# Altium schematic sheet EMMC.SchDoc
size A3; SheetNumber: 7; SheetTotal: 10
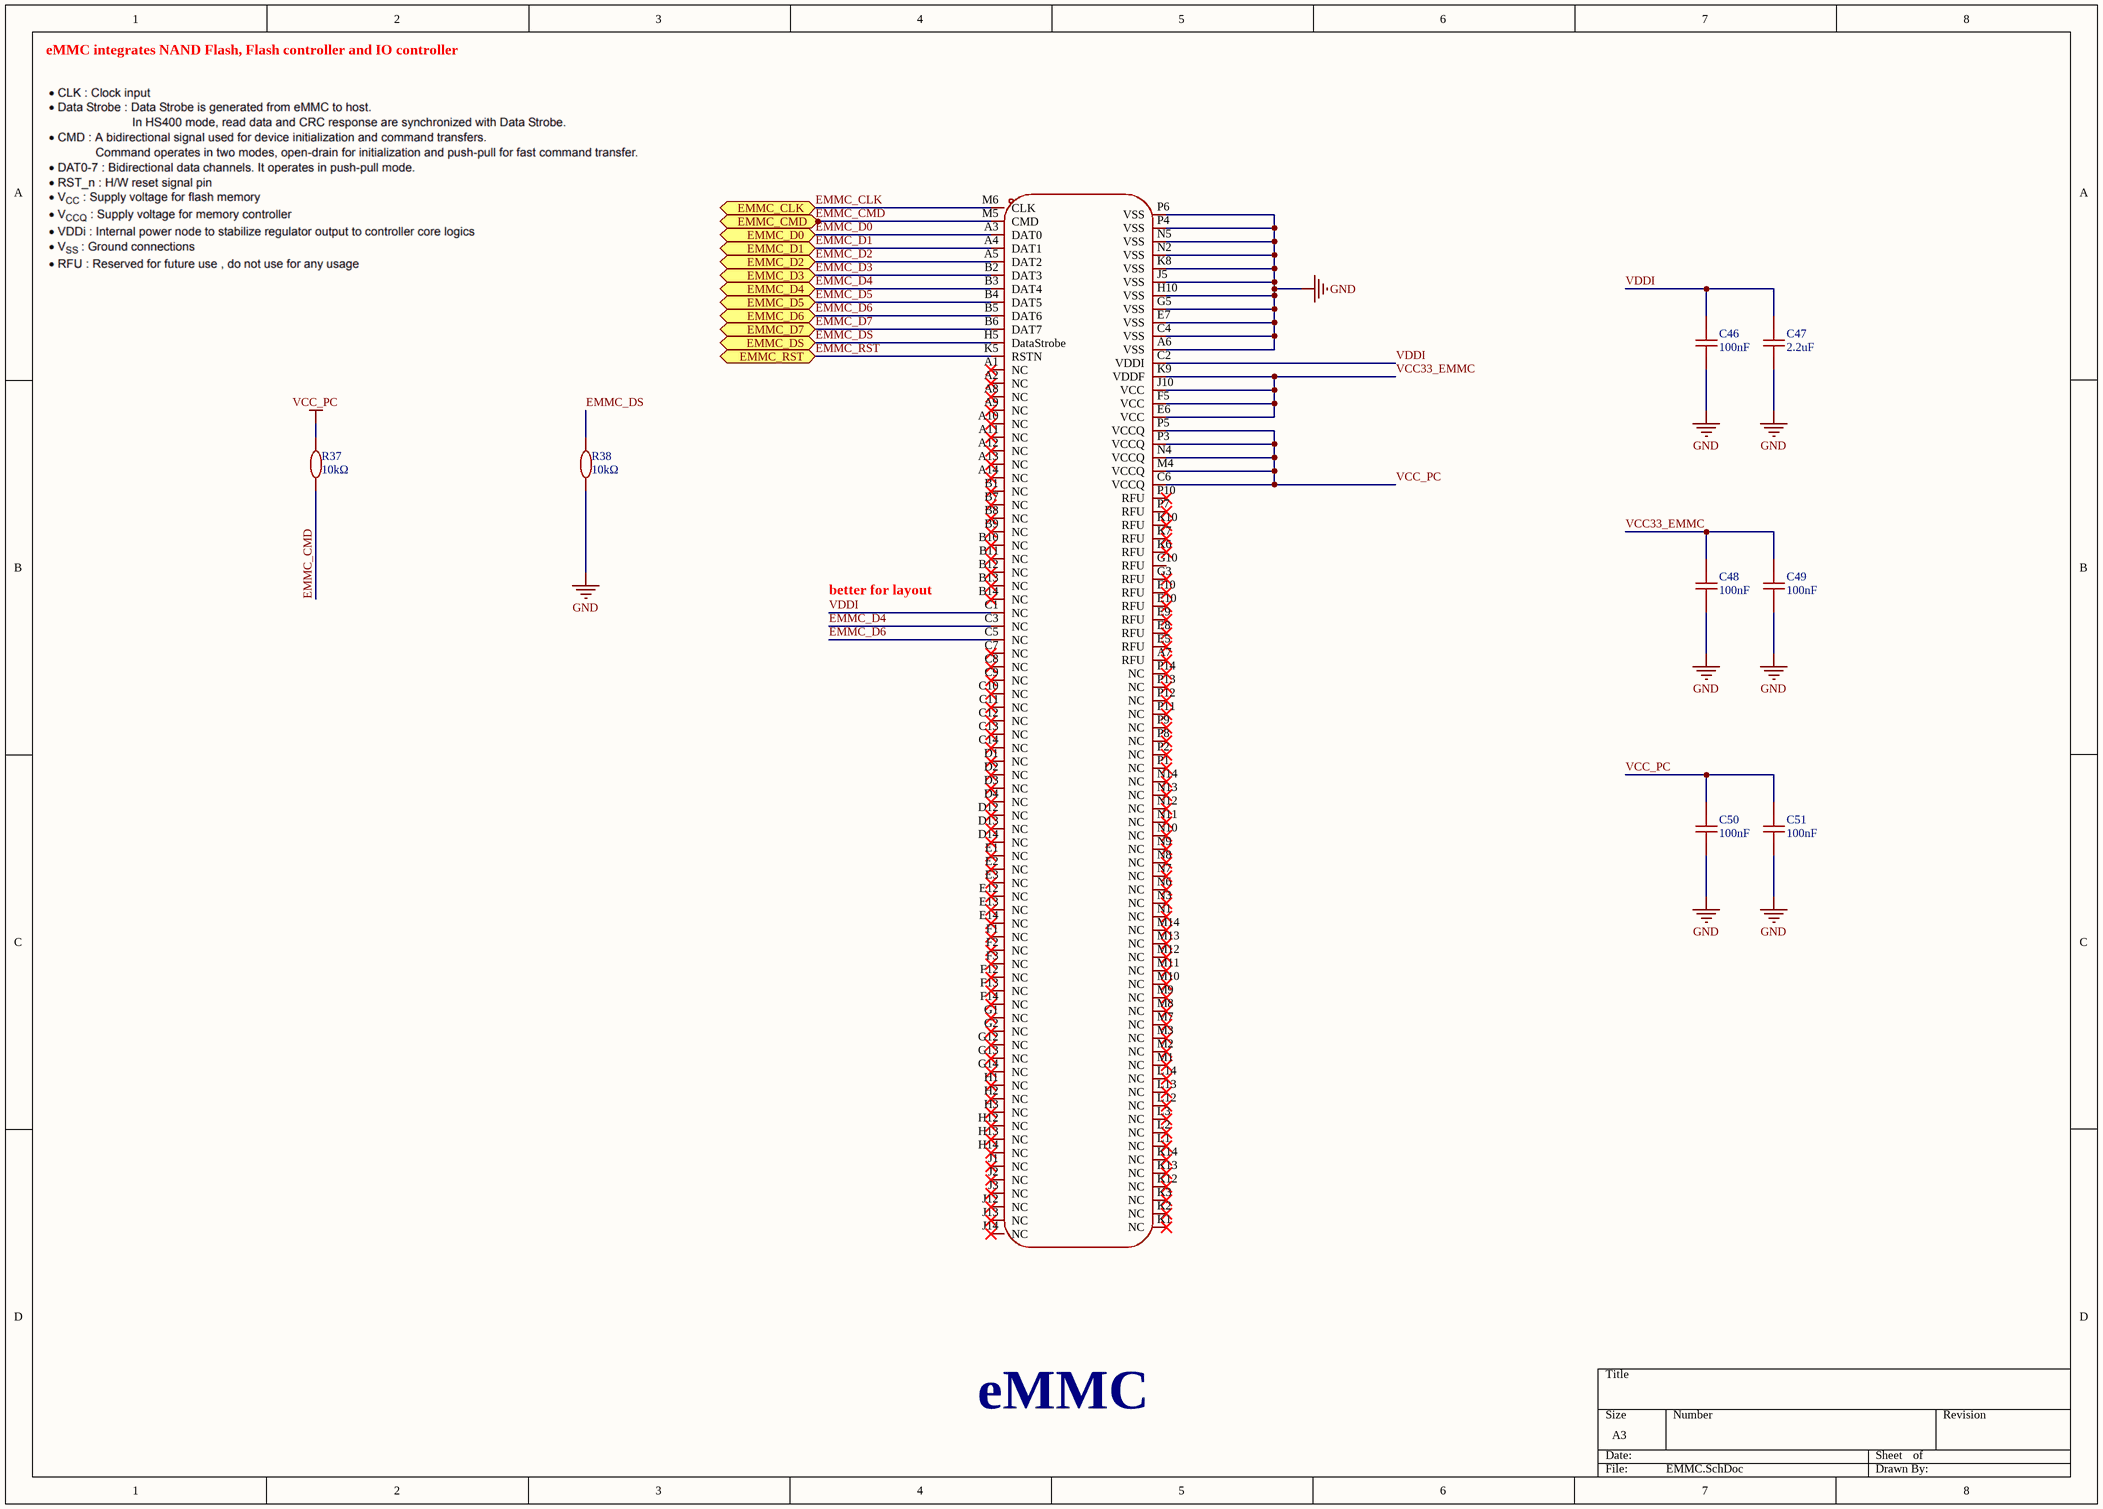
[diagram p0: EMMC.SchDoc]

## Parts
C46  100nF  [C0402]
C47  2.2uF  [C0402]
C48  100nF  [C0402]
C49  100nF  [C0402]
C50  100nF  [C0402]
C51  100nF  [C0402]
R37  10kΩ  [R0402]
R38  10kΩ  [R0402]
U3  KLM8G1GETF-B041  [FBGA-153_L13.0-W11.5-P0.50_KLMAG1JETD-B041]  (value not drawn)

## Ports
EMMC_CLK (bidir, see SoC_1[1A]), EMMC_CMD (bidir, see SoC_1[2A]), EMMC_D0 (bidir, see SoC_1[2A]), EMMC_D1 (bidir, see SoC_1[2B]), EMMC_D2 (bidir, see SoC_1[2B]), EMMC_D3 (bidir, see SoC_1[2B]), EMMC_D4 (bidir, see SoC_1[2B]), EMMC_D5 (bidir, see SoC_1[2B]), EMMC_D6 (bidir, see SoC_1[2B]), EMMC_D7 (bidir, see SoC_1[2B]), EMMC_DS (bidir, see SoC_1[2A]), EMMC_RST (bidir, see SoC_1[1B])

## Nets
GND: C46.1 C47.1 C48.1 C49.1 C50.1 C51.1 R38.1 U3.A6(VSS) U3.C4(VSS) U3.E7(VSS) U3.G5(VSS) U3.H10(VSS) U3.J5(VSS) U3.K8(VSS) U3.N2(VSS) U3.N5(VSS) U3.P4(VSS) U3.P6(VSS)
VCC_PC: C50.2 C51.2 R37.2 U3.C6(VCCQ) U3.M4(VCCQ) U3.N4(VCCQ) U3.P3(VCCQ) U3.P5(VCCQ)
EMMC_CLK: U3.M6(CLK) ; port EMMC_CLK
EMMC_CMD: R37.1 U3.M5(CMD) ; port EMMC_CMD
EMMC_D0: U3.A3(DAT0) ; port EMMC_D0
EMMC_D1: U3.A4(DAT1) ; port EMMC_D1
EMMC_D2: U3.A5(DAT2) ; port EMMC_D2
EMMC_D3: U3.B2(DAT3) ; port EMMC_D3
EMMC_D4: U3.B3(DAT4) U3.C3(NC) ; port EMMC_D4
EMMC_D5: U3.B4(DAT5) ; port EMMC_D5
EMMC_D6: U3.B5(DAT6) U3.C5(NC) ; port EMMC_D6
EMMC_D7: U3.B6(DAT7) ; port EMMC_D7
EMMC_DS: R38.2 U3.H5(DataStrobe) ; port EMMC_DS
EMMC_RST: U3.K5(RSTN) ; port EMMC_RST
VCC33_EMMC: C48.2 C49.2 U3.E6(VCC) U3.F5(VCC) U3.J10(VCC) U3.K9(VDDF)
VDDI: C46.2 C47.2 U3.C1(NC) U3.C2(VDDI)

Not connected (* = marked no-connect by the designer): U3 A1(NC)* A2(NC)* A7(RFU)* A8(NC)* A9(NC)* A10(NC)* A11(NC)* A12(NC)* A13(NC)* A14(NC)* B1(NC)* B7(NC)* B8(NC)* B9(NC)* B10(NC)* B11(NC)* B12(NC)* B13(NC)* B14(NC)* C7(NC)* C8(NC)* C9(NC)* C10(NC)* C11(NC)* C12(NC)* C13(NC)* C14(NC)* D1(NC)* D2(NC)* D3(NC)* D4(NC)* D12(NC)* D13(NC)* D14(NC)* E1(NC)* E2(NC)* E3(NC)* E5(RFU)* E8(RFU)* E9(RFU)* E10(RFU)* E12(NC)* E13(NC)* E14(NC)* F1(NC)* F2(NC)* F3(NC)* F10(RFU)* F12(NC)* F13(NC)* F14(NC)* G1(NC)* G2(NC)* G3(RFU)* G10(RFU) G12(NC)* G13(NC)* G14(NC)* H1(NC)* H2(NC)* H3(NC)* H12(NC)* H13(NC)* H14(NC)* J1(NC)* J2(NC)* J3(NC)* J12(NC)* J13(NC)* J14(NC)* K1(NC)* K2(NC)* K3(NC)* K6(RFU)* K7(RFU)* K10(RFU)* K12(NC)* K13(NC)* K14(NC)* L1(NC)* L2(NC)* L3(NC)* L12(NC)* L13(NC)* L14(NC)* M1(NC)* M2(NC)* M3(NC)* M7(NC)* M8(NC)* M9(NC)* M10(NC)* M11(NC)* M12(NC)* M13(NC)* M14(NC)* N1(NC)* N3(NC)* N6(NC)* N7(NC)* N8(NC)* N9(NC)* N10(NC)* N11(NC)* N12(NC)* N13(NC)* N14(NC)* P1(NC)* P2(NC)* P7(RFU)* P8(NC)* P9(NC)* P10(RFU)* P11(NC)* P12(NC)* P13(NC)* P14(NC)*

## Notes on the sheet
- eMMC integrates NAND Flash, Flash controller and IO controller
- (near U3) better for layout
- eMMC

## Library data of the parts
C46 C48-C51 = 100nF: 50V 100nF X7R ±10% 0402 Ceramic Capacitors ROHS
C47 = 2.2uF: 16V 2.2uF X5R ±10% 0402 Ceramic Capacitors ROHS
R37 R38 = 10kΩ: 62.5mW 10kΩ 50V ±100ppm/℃ Thick Film Resistor ±1% 0402 Chip Resistor - Surface Mount ROHS
U3 = KLM8G1GETF-B041_1: 8GB 2.7V~3.6V eMMC 5.1 330/50 MB/s FBGA-153(11.5x13) Memory (ICs) ROHS; Manufacturer: SAMSUNG(三星半导体); Add into BOM: yes; Reading Speed in Sequence: 330MB/S; Writing Speed in Sequence: 50MB/S; Controller Operating Voltage (VCCQ): 2.7V~3.6V；1.7V~1.95V; Symbol: KLM8G1GETF-B041; Device: KLM8G1GETF-B041; LCSC Part Name: KLM8G1GETF-B041; Supplier Part: C499918; Manufacturer Part: KLM8G1GETF-B041; Supplier Footprint: FBGA-153(11.5x13); JLCPCB Part Class: Extended Part; Datasheet: https://item.szlcsc.com/datasheet/KLM8G1GETF-B041/512098.html; Supplier: LCSC; Convert to PCB: yes; configuration: -; Interface: eMMC 5.1; Voltage - Supply: 2.7V~3.6V; Operating Temperature: -25℃~+85℃; Sequential Read/Write (MB/s): 330/50 MB/s; Random Read/Write (IOPS): -; Memory Size: 8GB; NAND Operating Voltage (VCCF): 2.7V~3.6V